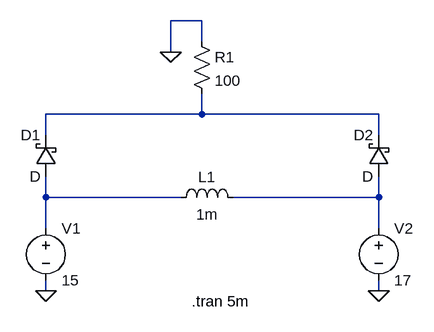
[diagram p0: schematic Diode schottky alims test 1.asc]
Diode schottky alims test 1.asc, the LTspice schematic file:
Version 4
SHEET 1 880 680
WIRE 352 32 304 32
WIRE 352 64 352 32
WIRE 304 80 304 32
WIRE 352 176 352 144
WIRE 352 176 112 176
WIRE 624 176 352 176
WIRE 112 208 112 176
WIRE 624 208 624 176
WIRE 112 304 112 272
WIRE 320 304 112 304
WIRE 624 304 624 272
WIRE 624 304 400 304
WIRE 112 352 112 304
WIRE 624 352 624 304
WIRE 112 448 112 432
WIRE 624 448 624 432
FLAG 624 448 0
FLAG 112 448 0
FLAG 304 80 0
SYMBOL voltage 112 336 R0
SYMATTR InstName V1
SYMATTR Value 15
SYMBOL voltage 624 336 R0
SYMATTR InstName V2
SYMATTR Value 17
SYMBOL ind 304 320 R270
WINDOW 0 32 56 VTop 2
WINDOW 3 5 56 VBottom 2
SYMATTR InstName L1
SYMATTR Value 1m
SYMBOL schottky 128 272 R180
WINDOW 0 24 64 Left 2
WINDOW 3 24 0 Left 2
SYMATTR InstName D1
SYMBOL schottky 640 272 R180
WINDOW 0 24 64 Left 2
WINDOW 3 24 0 Left 2
SYMATTR InstName D2
SYMBOL res 336 48 R0
SYMATTR InstName R1
SYMATTR Value 100
TEXT 336 464 Left 2 !.tran 5m

The netlist it stands for:
* Diode schottky alims test 1.asc
V1 N002 0 15
V2 N003 0 17
L1 N002 N003 1m
D1 N002 N001 D
D2 N003 N001 D
R1 0 N001 100
.model D D
.lib standard.dio
.tran 5m
.backanno
.end